# EAGLE design érintő (EAGLE 6.5.0)
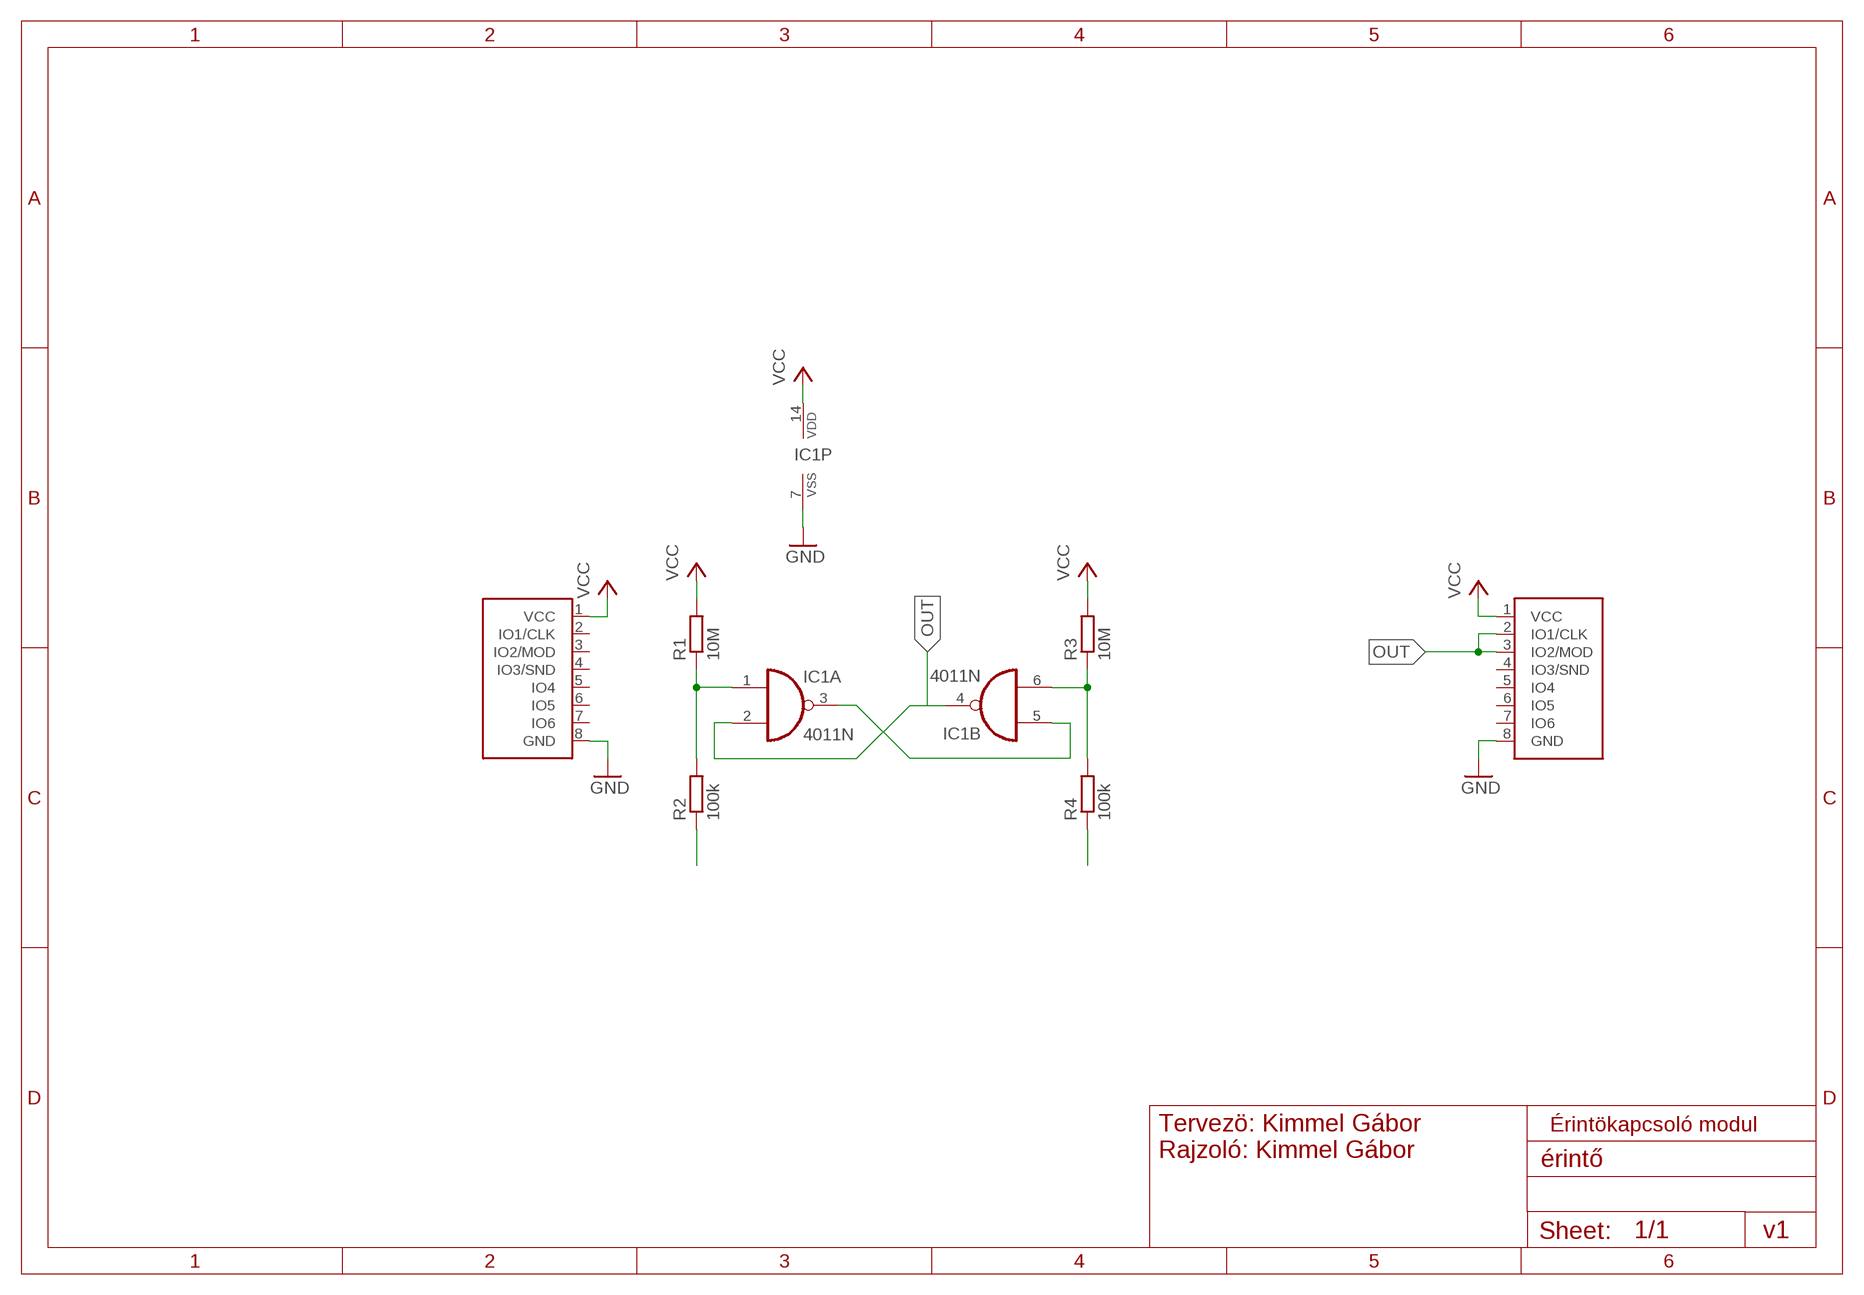
[diagram p0: schematic, sheet 1]

## Parts
IC1  4011N  [DIL14]
R1  10M  R-EU_0309/12  [0309/12]
R2  100k  R-EU_0309/12  [0309/12]
R3  10M  R-EU_0309/12  [0309/12]
R4  100k  R-EU_0309/12  [0309/12]
U$1  GANZ-CONNECTOR  [FE08W]
U$2  GANZ-CONNECTOR-OUT  [MA08-1W]

## Nets
GND: IC1.7(P:VSS) U$1.8(GND) U$2.8(GND)
N$2: IC1.3(A:O) IC1.5(B:I0)
N$3: IC1.1(A:I0) R1.1 R2.2
N$5: IC1.6(B:I1) R3.1 R4.2
OUT: IC1.2(A:I1) IC1.4(B:O) U$2.2(IO1/CLK) U$2.3(IO2/MOD)
PAD1: R2.1
PAD2: R4.1
VCC: IC1.14(P:VDD) R1.2 R3.2 U$1.1(VCC) U$2.1(VCC)
Unconnected: IC1.8(C:I0) IC1.9(C:I1) IC1.10(C:O) IC1.11(D:O) IC1.12(D:I0) IC1.13(D:I1) U$1.2(IO1/CLK) U$1.3(IO2/MOD) U$1.4(IO3/SND) U$1.5(IO4) U$1.6(IO5) U$1.7(IO6) U$2.4(IO3/SND) U$2.5(IO4) U$2.6(IO5) U$2.7(IO6)

## Notes on the sheet
- Tervezö: Kimmel Gábor
  Rajzoló: Kimmel Gábor
- Érintökapcsoló modul
- v1

## Library data of the parts
IC1 = 40xx:4011: Quad 2-input NAND
R1-R4 = resistor:R-EU_: RESISTOR, European symbol
U$1 = ganzlib:GANZ-CONNECTOR
U$2 = ganzlib:GANZ-CONNECTOR-OUT

## Board
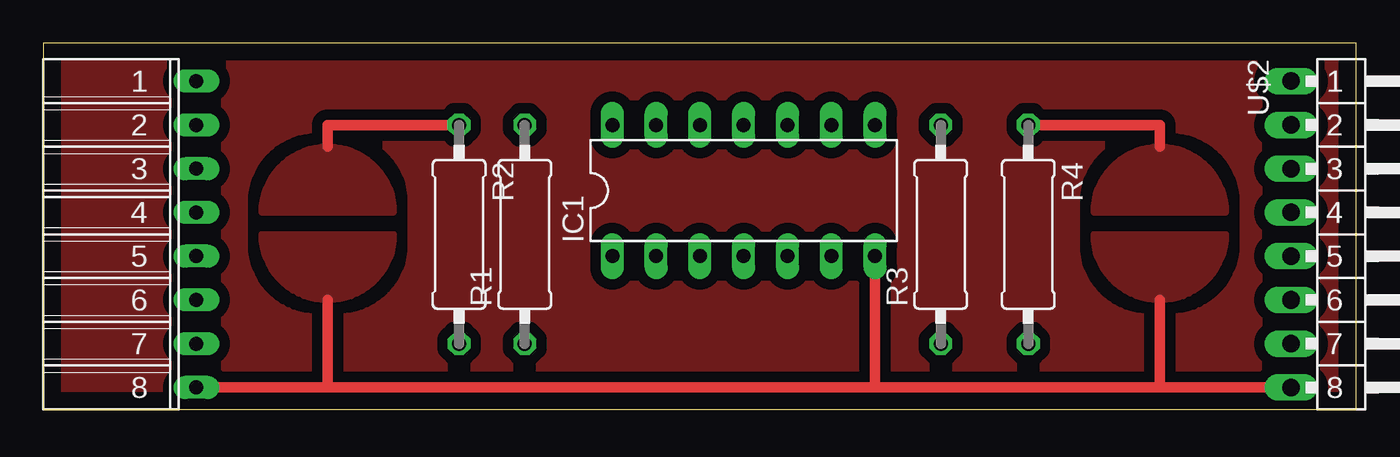
[diagram p1: board, top side]
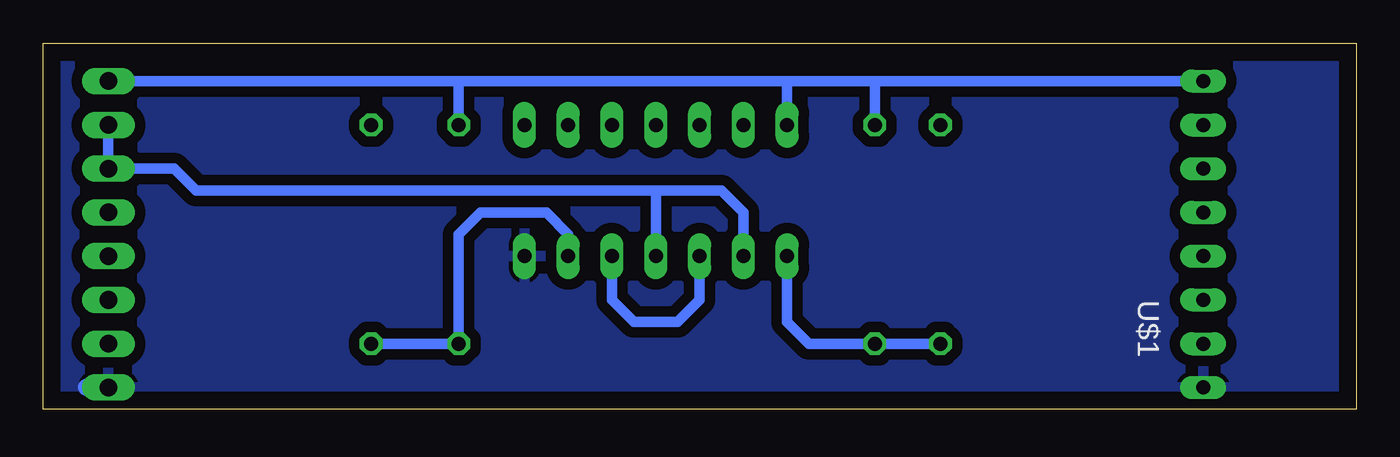
[diagram p2: board, bottom side, seen from below]

Size 76.18 x 21.26 mm. Coordinates in mm from the lower left corner, seen from the top.
Outline: 0,0 76.18,0 76.18,21.26 0,21.26 0,0
Copper layers (1*16): Top 0.035mm / dielectric 1.5mm / Bottom 0.035mm
Design rules "default *": minimum track width 10mil, minimum drill 24mil, track to track 8mil, track to pad 8mil, pad to pad 8mil, via to via 8mil, smd to smd 8mil, copper to edge 40mil, drill to drill 8mil, minimum pad ring 10mil, minimum via ring 8mil, stop-mask expansion 4mil, vias tented up to drill 0mil, thermal gap 10mil

### Footprints (pad centres in the part's own frame; a part is rotated, then mirrored left to right if it is on the bottom)
DIL14 = drill 0.813 long: 1 -7.62,-3.81; 2 -5.08,-3.81; 3 -2.54,-3.81; 4 0,-3.81; 5 2.54,-3.81; 6 5.08,-3.81; 7 7.62,-3.81; 8 7.62,3.81; 9 5.08,3.81; 10 2.54,3.81; 11 0,3.81; 12 -2.54,3.81; 13 -5.08,3.81; 14 -7.62,3.81
0309/12 = drill 0.813 octagon: 1 -6.35,0; 2 6.35,0
FE08W = drill 0.813 long: 1 5.08,8.89; 2 5.08,6.35; 3 5.08,3.81; 4 5.08,1.27; 5 5.08,-1.27; 6 5.08,-3.81; 7 5.08,-6.35; 8 5.08,-8.89
MA08-1W = drill 1.016 long: 1 0,8.89; 2 0,6.35; 3 0,3.81; 4 0,1.27; 5 0,-1.27; 6 0,-3.81; 7 0,-6.35; 8 0,-8.89

### Placement (x,y rotation side)
IC1  40.64,12.7 0 top
R1  27.94,10.16 90 top
R2  24.13,10.16 270 top
R3  52.07,10.16 90 top
R4  57.15,10.16 270 top
U$1  3.81,10.16 0 top
U$2  72.39,10.16 0 top

### Tracks (layer width: path | path; a pad name or v marks a point on that pad's centre or on a via)
GND
  Top 0.61: U$1.8 16.51,1.27 | 16.51,6.35 16.51,1.27 | 16.51,1.27 48.26,1.27 | 48.26,1.27 64.77,1.27 | 64.77,6.35 64.77,1.27 | 64.77,1.27 U$2.8 | IC1.7 48.26,1.27
  Bottom 1.016: U$2.8 73.66,1.27
  pour Top: 12.7,10.16 20.32,10.16 arc-90 16.51,6.35 arc-90
  pour Top: 60.96,10.16 68.58,10.16 arc-90 64.77,6.35 arc-90
  pour Bottom (isolate 0.61): 0,21.59 76.2,21.59 76.2,0 0,0
N$1
  pour Top (isolate 0.61, rank 2): 0,21.59 76.2,21.59 76.2,0 0,0
N$2
  Bottom 0.61: IC1.3 38.1,6.35 39.37,5.08 41.91,5.08 43.18,6.35 IC1.5
N$3
  Bottom 0.61: R2.2 R1.1 31.75,3.81 33.02,5.08 IC1.1
N$5
  Bottom 0.61: R4.2 R3.1 52.07,10.16 50.8,11.43 46.99,11.43 45.72,10.16 IC1.6
OUT
  Bottom 0.61: U$2.2 U$2.3 68.58,13.97 67.31,12.7 40.64,12.7 | IC1.2 35.56,11.43 36.83,12.7 40.64,12.7 | 40.64,12.7 IC1.4
PAD1
  Top 0.61: R2.1 16.51,16.51 16.51,15.24
  pour Top: 12.7,11.43 arc-90 16.51,15.24 arc-90 20.32,11.43
PAD2
  Top 0.61: R4.1 64.77,16.51 64.77,15.24
  pour Top: 60.96,11.43 arc-90 64.77,15.24 arc-90 68.58,11.43
VCC
  Bottom 0.61: U$1.1 27.94,19.05 | 27.94,19.05 33.02,19.05 | 33.02,19.05 52.07,19.05 | 52.07,19.05 U$2.1 | IC1.14 33.02,19.05 | R1.2 27.94,19.05 | R3.2 52.07,19.05